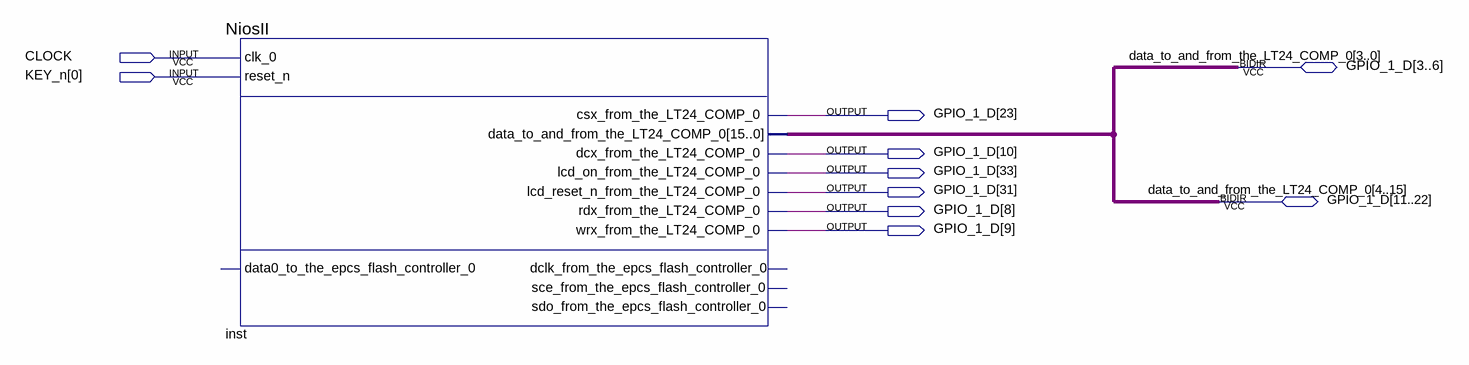
[diagram p0: schematic sheet]
// Quartus schematic LT24_Project.bdf as structural Verilog: 1 symbols, 10 pins
module LT24_Project (
  input  CLOCK,
  input  [0:0] KEY_n,
  inout  [3:33] GPIO_1_D
);

  NiosII inst (
    .clk_0(CLOCK), .reset_n(KEY_n[0]), .csx_from_the_LT24_COMP_0(GPIO_1_D[23]),
    .dcx_from_the_LT24_COMP_0(GPIO_1_D[10]), .lcd_on_from_the_LT24_COMP_0(GPIO_1_D[33]),
    .lcd_reset_n_from_the_LT24_COMP_0(GPIO_1_D[31]), .rdx_from_the_LT24_COMP_0(GPIO_1_D[8]),
    .wrx_from_the_LT24_COMP_0(GPIO_1_D[9]),
    .data_to_and_from_the_LT24_COMP_0({GPIO_1_D[22], GPIO_1_D[21], GPIO_1_D[20], GPIO_1_D[19], GPIO_1_D[18], GPIO_1_D[17], GPIO_1_D[16], GPIO_1_D[15], GPIO_1_D[14], GPIO_1_D[13], GPIO_1_D[12], GPIO_1_D[11], GPIO_1_D[3:6]}));  // open: data0_to_the_epcs_flash_controller_0, dclk_from_the_epcs_flash_controller_0, sce_from_the_epcs_flash_controller_0, sdo_from_the_epcs_flash_controller_0

  // Other names for the same wires on the sheet: data_to_and_from_the_LT24_COMP_0[15:0] = {GPIO_1_D[22], GPIO_1_D[21], GPIO_1_D[20], GPIO_1_D[19], GPIO_1_D[18], GPIO_1_D[17], GPIO_1_D[16], GPIO_1_D[15], GPIO_1_D[14], GPIO_1_D[13], GPIO_1_D[12], GPIO_1_D[11], GPIO_1_D[3:6]}
endmodule
